# Altium schematic sheet Firing_Angle_Controlling.SchDoc
size A
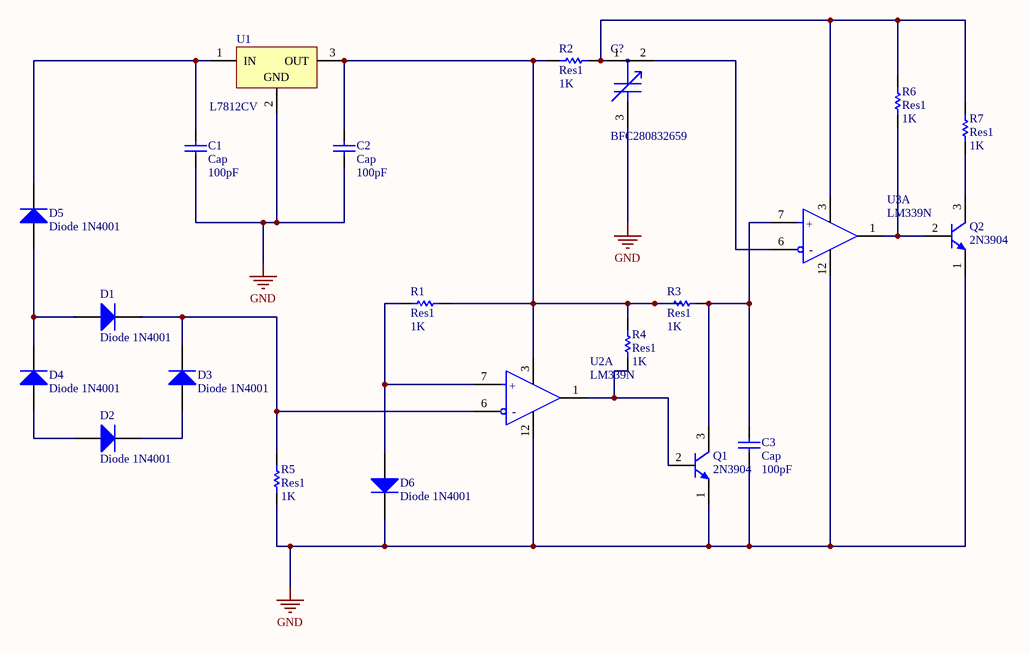
[diagram p0: Firing_Angle_Controlling.SchDoc]

## Parts
C1  Cap  value 100pF  [RAD-0.3]
C2  Cap  value 100pF  [RAD-0.3]
C3  Cap  value 100pF  [RAD-0.3]
C?  BFC280832659  [FP-BFC280832659-MFG]
D1  Diode 1N4001  [DO-41]
D2  Diode 1N4001  [DO-41]
D3  Diode 1N4001  [DO-41]
D4  Diode 1N4001  [DO-41]
D5  Diode 1N4001  [DO-41]
D6  Diode 1N4001  [DO-41]
Q1  2N3904  [ONSC-TO-92-3-29-11]
Q2  2N3904  [ONSC-TO-92-3-29-11]
R1  Res1  value 1K  [AXIAL-0.3]
R2  Res1  value 1K  [AXIAL-0.3]
R3  Res1  value 1K  [AXIAL-0.3]
R4  Res1  value 1K  [AXIAL-0.3]
R5  Res1  value 1K  [AXIAL-0.3]
R6  Res1  value 1K  [AXIAL-0.3]
R7  Res1  value 1K  [AXIAL-0.3]
U1  L7812CV  [TO220]
U2  LM339N  [FP-N0014A-MFG]  (part A of 4)
U3  LM339N  [FP-N0014A-MFG]  (part A of 4)

## Nets
GND: C1.1 C2.1 C3.1 C?.3(S) D6.2(K) Q1.1(E) Q2.1(E) R5.1 U1.2(GND) U2.12(GND) U3.12(GND)
NetC1_2: C1.2 D5.2(K) U1.1(IN)
NetC2_2: C2.2 R1.2 R2.1 R3.1 R4.2 U1.3(OUT) U2.3(VCC)
NetC3_2: C3.2 Q1.3(C) R3.2 U3.7(1IN+)
NetC?_1: C?.1(R) R2.2 R6.2 R7.2 U3.3(VCC)
NetC?_2: C?.2(R) U3.6(1IN-)
NetD1_1: D1.1(A) D4.2(K) D5.1(A)
NetD1_2: D1.2(K) D3.2(K) R5.2 U2.6(1IN-)
NetD2_1: D2.1(A) D4.1(A)
NetD2_2: D2.2(K) D3.1(A)
NetD6_1: D6.1(A) R1.1 U2.7(1IN+)
NetQ1_2: Q1.2(B) R4.1 U2.1(1OUT)
NetQ2_2: Q2.2(B) R6.1 U3.1(1OUT)
NetQ2_3: Q2.3(C) R7.1

## Notes on the sheet
- (in symbol CMP-0055-00143-4, part A) +; -

## Library data of the parts
C1-C3 = Cap: Capacitor; Published: 8-Jun-2000; LatestRevisionDate: 17-Jul-2002; LatestRevisionNote: Re-released for DXP Platform.; PackageReference: RAD-0.3; Publisher: Altium Limited; PackageDescription: Radial Cap, Thru-Hole; 2 Leads; 0.3 in Pin Spacing
C? = CMP-02422-000001-1: CAP TRIMMER 5.5-65PF 150V TH; Manufacturer: Vishay BC Components; Temperature Coefficient: +300/-700ppm/°C; Material: Polypropylene; Description: CAP, TRIMMER, TOP, 5.5- 65PF, 150V; Category: Cap; Voltage Rating: 150V; Octopart: https://octopart.com/bfc280832659-vishay-41937824; Device Class L2: Capacitors; Device Class L1: Passive Components; Value: 5.5-65pF; Temperature Range Low: -40°C; Capacitance: 5.5-65pF; ComponentLink2URL: https://www.vishay.com/docs/28528/bfc2808-10mm.pdf; Temperature: -40°C to +70°C; ComponentLink2Description: Datasheet; Temperature Range High: +70°C; Device Class L3: Trimmer / Variable Capacitors; Manufacturer Part Number: BFC280832659; RoHS: TRUE; Lead Free: Yes; Digikey Description: CAP TRIMMER 5.5-65PF 150V TH; Automotive: No; Package: BFC280832659; Mouser Description: Trimmer / Variable Capacitors TRIMMER CAPACITOR; Height: 11mm
D1-D6 = Diode 1N4001: 1 Amp General Purpose Rectifier; Published: 8-Jun-2000; LatestRevisionDate: 17-Jul-2002; LatestRevisionNote: Re-released for DXP Platform.; DatasheetVersion: 1998; PackageVersion: Aug-1999; PackageReference: DO-41; Publisher: Altium Limited; PackageDescription: Diode, Axial; Body 5.2 x 2.7 mm (LxDia. max), Lead Dia. 0.86 mm (max); Code_JEDEC: DO-204-AL; ComponentLink1Description: Manufacturer Link; ComponentLink1URL: http://www.fairchildsemi.com/; ComponentLink2Description: Datasheet; ComponentLink2URL: http://www.fairchildsemi.com/ds/1N%2F1N4001.pdf
Q1 Q2 = CMP-2000-05562-1: General Purpose Transistor, NPN Silicon, 200 mA, 60 V, -55 to 150 degC, 3-Pin TO-92, RoHS, Bulk; Manufacturer: ONSemiconductor; Emitter- Base Voltage VEBO: 6V; Maximum Power Dissipation: 625mW; Maximum DC Collector Current: 0.2A; Collector- Emitter Voltage VCEO Max: 40V; Collector- Base Voltage VCBO: 60V; DC Collector/Base Gain hfe Min: 60; Configuration: Single; Collector-Emitter Saturation Voltage: 0.3V; Gain Bandwidth Product fT: 270MHz; Mounting Style: ThroughHole; Package / Case: TO-92-3(TO-226); Mounting Technology: ThroughHole; Minimum Operating Temperature: -65C; Datasheet Version: Rev. 8, 08/2012; Product Category: BipolarTransistors-BJT; Factory Pack Quantity: 5000; Transistor Polarity: NPN; Package Description: 3-Pin Transistor Outline, Body 4.825 x 3.685 mm, Pitch 1.27 mm; RoHS: Details; Datasheet URL: https://datasheet.ciiva.com/4725/2n3903-d-285841-4725808.pdf; Packaging: Bulk; Maximum Operating Temperature: +150C; Package Reference: TO-92-3-29-11; Brand: ONSemiconductor; Manufacturer URL: http://www.onsemi.com/
R1-R7 = Res1: Resistor; Published: 8-Jun-2000; LatestRevisionDate: 17-Jul-2002; LatestRevisionNote: Re-released for DXP Platform.; PackageReference: AXIAL-0.3; Publisher: Altium Limited; PackageDescription: Axial Device, Thru-Hole; 2 Leads; 0.3 in Pin Spacing
U1 = CMP-0244-00450-1: Positive Voltage Regulator, 12V, 3-Pin TO-220; PackageDescription: TO, Thru-Hole, Vertical, Heatsink Mounted; 3 In-Line Leads; Pitch 2.54 mm; ComponentLink3URL: http://www.st.com/internet/com/TECHNICAL_RESOURCES/TECHNICAL_LITERATURE/PACKAGE_INFORMATION/CD00004649.pdf; ComponentLink1URL: http://www.st.com; ComponentLink2Description: Datasheet; ComponentLink3Description: Package Specification; ComponentLink2URL: http://www.st.com/internet/com/TECHNICAL_RESOURCES/TECHNICAL_LITERATURE/DATASHEET/CD00000444.pdf; DatasheetVersion: 16/11/2011; PackageVersion: ver3.0; PackageReference: TO220; ComponentLink1Description: Manufacturer URL
U2 U3 = CMP-0055-00143-4: IC QUAD DIFF COMPARATOR 14-DIP; Power Dissipation: 1.05kW; Response Time: 1.3us; Max Input Current: 250nA; Max Supply Current: 500uA; Output Current: 20mA; Output Type: TTL; Max Dual Supply Voltage: 15V; Voltage Gain: 106.02dB; Min Supply Voltage: 2V; Max Power Dissipation: 1.05W; Quiescent Current: 2.5mA; Nominal Supply Current: 2mA; Input Offset Voltage (Vos): 5mV; Number of Channels: 4; Output Current per Channel: 6mA; Max Supply Voltage: 30V; Min Dual Supply Voltage: 1V; Dual Supply Voltage: 9V; REACH SVHC: No SVHC; Max Operating Temperature: 70°C; Case/Package: PDIP; Weight: 0.032734oz; Radiation Hardening: No; Min Operating Temperature: 0°C; Number of Pins: 14; Contact Plating: Gold; Package Quantity: 25; Lead Free: Lead Free; Height: 4.57mm; Packaging: Rail/Tube; Input Bias Current: 250nA; Number of Elements: 4; Mount: Through Hole; Width: 6.35mm; Length: 19.3mm